# Altium project Плата измерителя УШЯИ.687243.352.PrjPcb
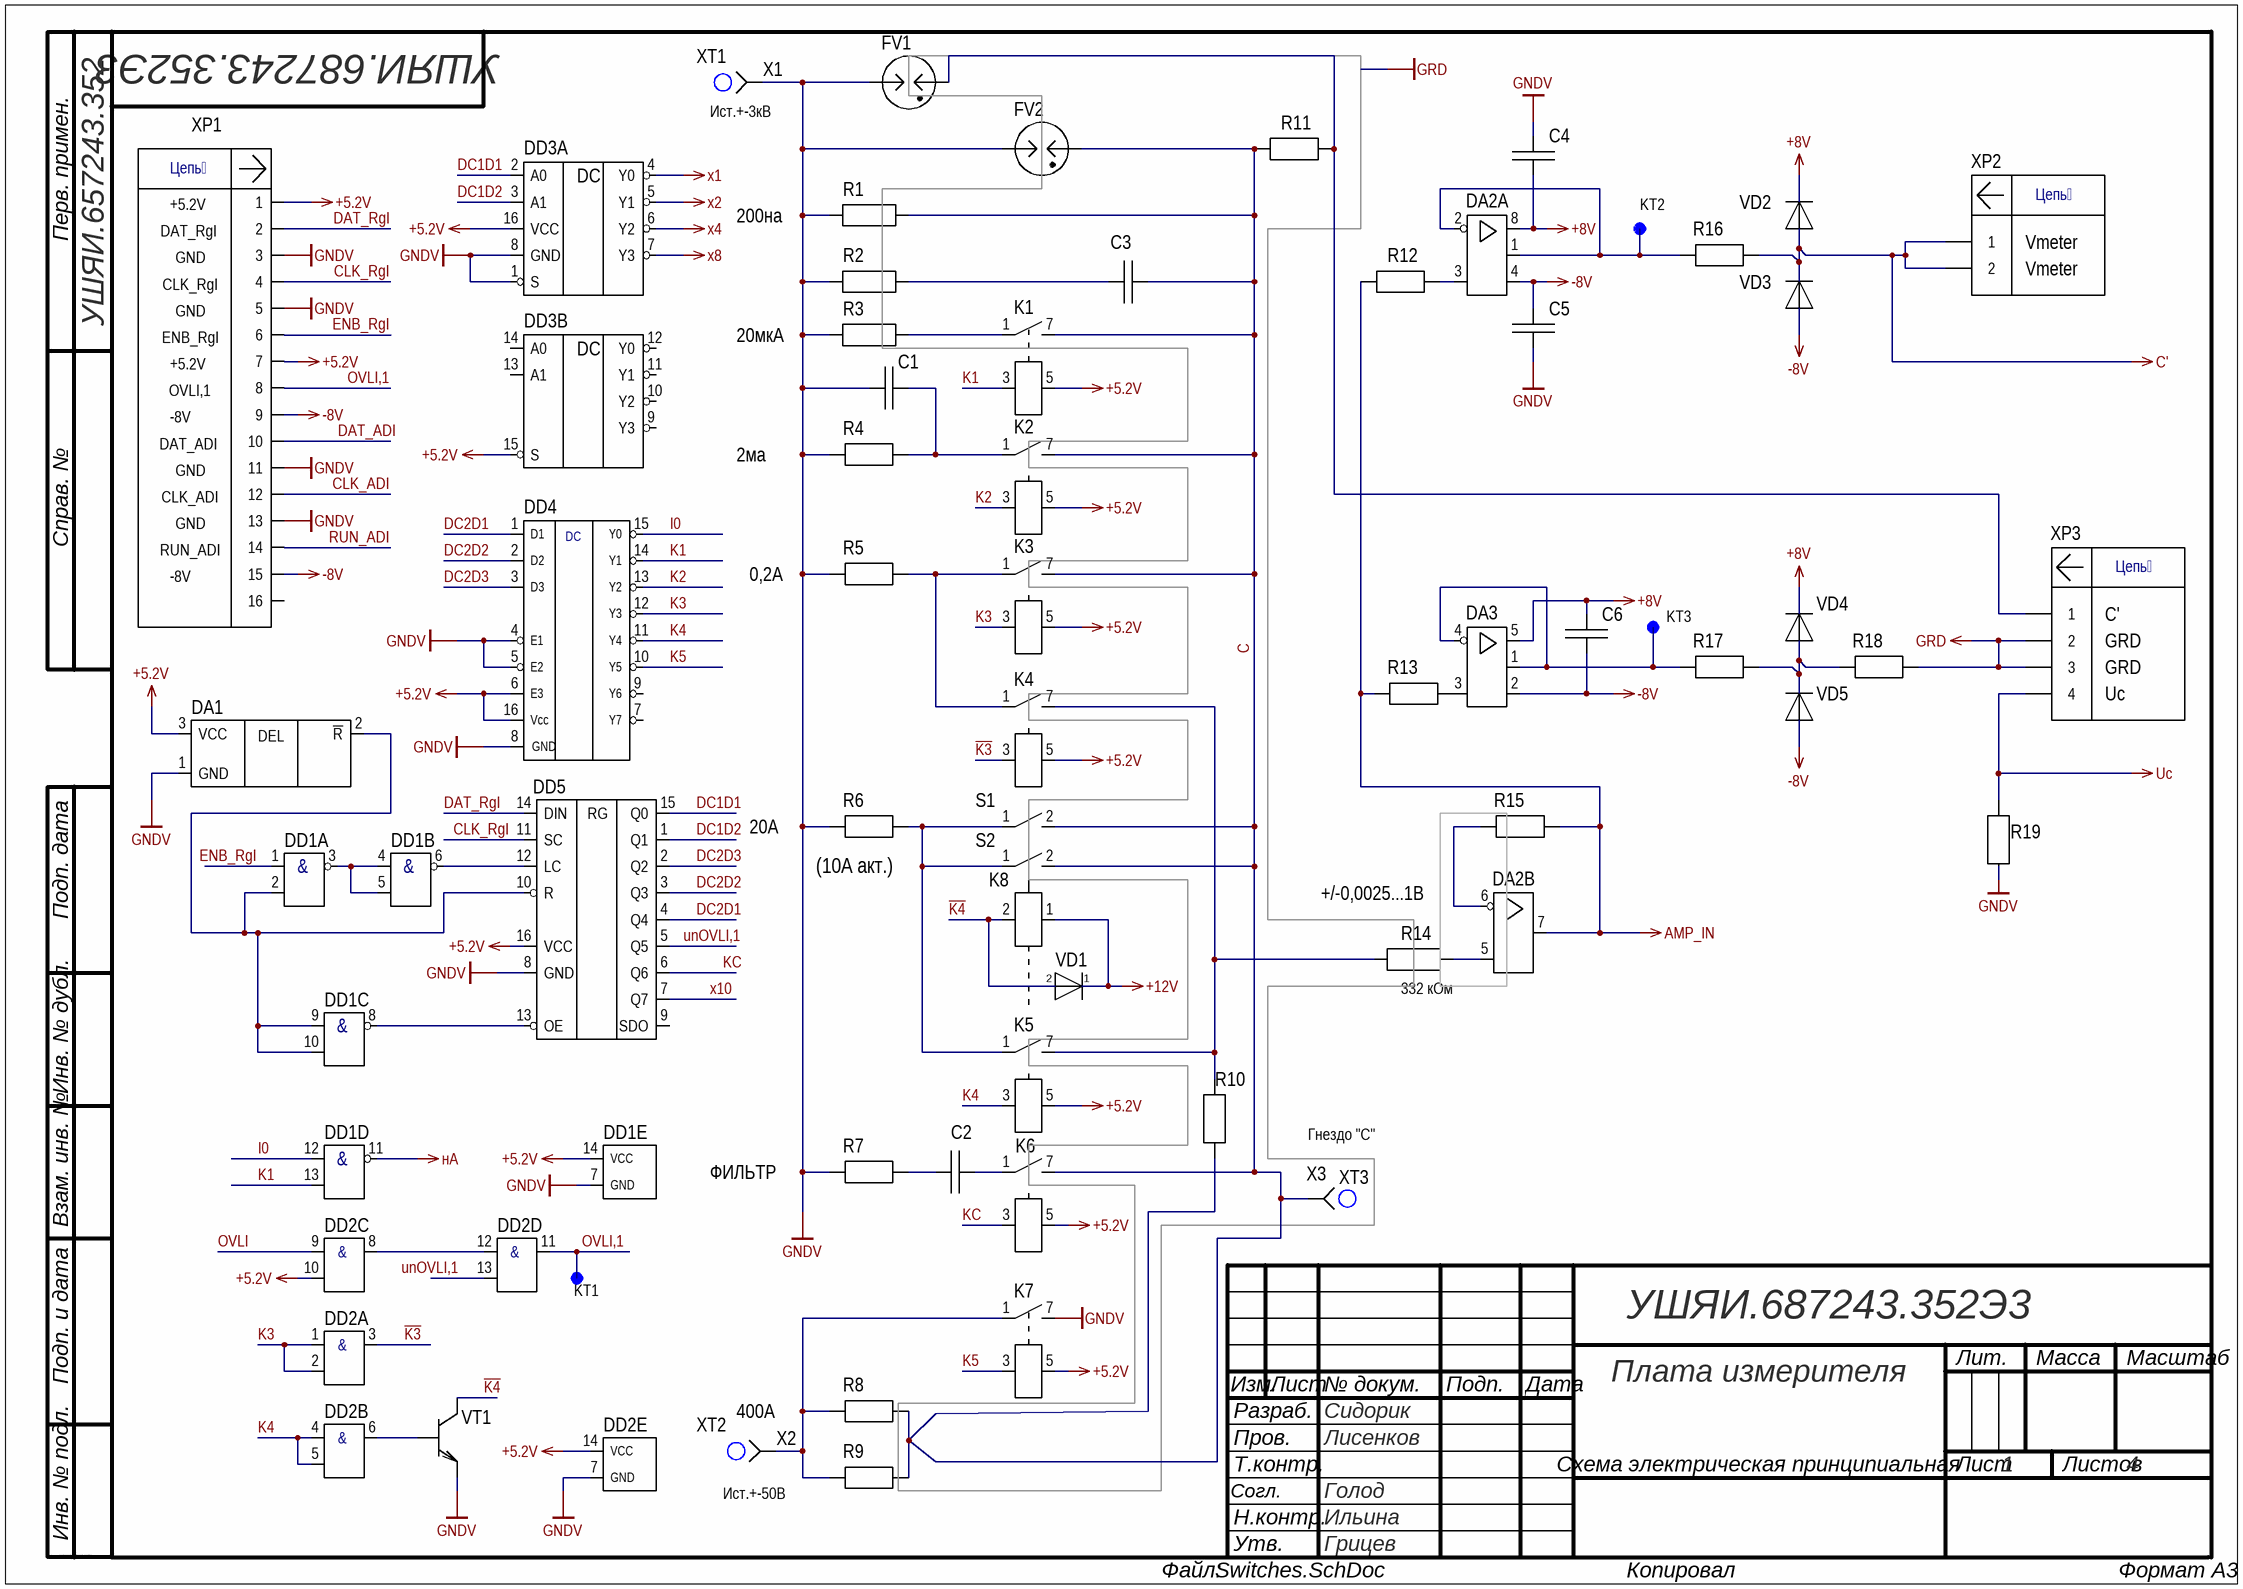
[diagram p0: Switches.SchDoc]
Вид_документа_SCH: Схема электрическая принципиальная; Документация0: А4#УШЯИ.687243.352#Сборочный чертеж (СБ)#СБ##; Документация1: А4#УШЯИ.687243.352#Перечень элементов (ПЭ3)#ПЭ3##; Документация2: А4#УШЯИ.687243.352#Схема электрическая принципиальная (Э3)#Э3##; Код_документа_SCH: Э3; Наименование: Плата измерителя; Наименование1: Плата измерителя; Наименование_PCB: Плата печатная; Обозначение: УШЯИ.687243.352; Обозначение_PCB: УШЯИ.758725.634; Обозначение_Код: УШЯИ.687243.352Э3; Перв.Примен.: УШЯИ.657243.352; ПервПримен: УШЯИ.657243.352; Характер_работы: Согл.; п_Доп_графа: Голод; п_Доп_графа_Р: Голод; п_Н_контр: Ильина; п_Н_контр_Р: Ильина; п_Пров: Лисенков; п_Пров_Р: Лисенков; п_Разраб: Сидорик; п_Разраб_Р: Сидорик; п_Т_Контр: Андриянчик; п_Утв: Грицев; п_Утв_Р: Грицев
4 sheets, 199 parts. Net scope: global (net labels, ports and power ports of the same name join across sheets).
Board file: УШЯИ 758725.634.PcbDoc
Sheets:
  Switches.SchDoc
  Amplifier.SchDoc
  Comparator.SchDoc
  PowerSupply.SchDoc

## Sheet Switches.SchDoc
size 420 x 297 mm; SheetNumber: 1; SheetTotal: 4

### Parts
C1  1206-XP7-630 B-3,3 нФ+-10%  [CAP: 1206]  (value not drawn)
C2  1206-XP7-500 B-15 нФ+-10%  [CAP: 1206]  (value not drawn)
C3  1206-NP0-500 B-270 пФ+-5%  [CAP: 1206]  (value not drawn)
C4  1206-X7R-50 B-0,1 мкФ+-10%  [CAP: 1206]  (value not drawn)
C5  1206-X7R-50 B-0,1 мкФ+-10%  [CAP: 1206]  (value not drawn)
C6  1206-X7R-50 B-0,1 мкФ+-10%  [CAP: 1206]  (value not drawn)
DA1  MAX809S  [SOT-23-3]  (value not drawn)
DA2  TLV9152IDR  [8-SOIC]  (value not drawn)  (parts A,B of 2)
DA3  TLV9151IDR  [SOT-23-5]  (value not drawn)
DD1  IN74HC00AD  [14-soic]  (value not drawn)  (parts A,B,C,D,E of 5)
DD2  IN74HC08AD  [14-SOIC]  (value not drawn)  (parts A,B,C,D,E of 5)
DD3  IN74HC139AD  [16-SOIC]  (value not drawn)  (parts A,B of 2)
DD4  IN74HC138AD  [16-SOIC]  (value not drawn)
DD5  IN74HC595AD  [16-SOIC]  (value not drawn)
FV1  2027-09-B19  [2027-09-B19]  (value not drawn)
FV2  2027-09-B19  [2027-09-B19]  (value not drawn)
K1  SIL05-1A72-71L  [SIL051A7271L]  (value not drawn)
K2  SIL05-1A72-71L  [SIL051A7271L]  (value not drawn)
K3  SIL05-1A72-71L  [SIL051A7271L]  (value not drawn)
K4  SIL05-1A72-71L  [SIL051A7271L]  (value not drawn)
K5  SIL05-1A72-71L  [SIL051A7271L]  (value not drawn)
K6  SIL05-1A72-71L  [SIL051A7271L]  (value not drawn)
K7  SIL05-1A72-71L  [SIL051A7271L]  (value not drawn)
K8  УШЯИ.685442.092vs2Rel  [УШЯИ.685442.092vs2Rel]  (value not drawn)
KT1  OTV10  [OTV10]  (value not drawn)  (no BOM)
KT2  OTV10  [OTV10]  (value not drawn)  (no BOM)
KT3  OTV10  [OTV10]  (value not drawn)  (no BOM)
R1  С2-29В-0,25-4,99 МОм +-0.1%  [С2-29В-0,25(140.02.0204.00.00)]  (value not drawn)
R2  С2-29В-0,125-22 Ом +-0.1%-1,0-А  [С2-29В-0,125(140.02.0202.00.00)]  (value not drawn)
R3  С2-29В-0,125-49,9 кОм +-0.1%-1,0-А  [С2-29В-0,125(140.02.0202.00.00)]  (value not drawn)
R4  1206-499 Ом+-0,1%  [1206]  (value not drawn)
R5  1206-4,99 Ом+-0,1%  [1206]  (value not drawn)
R6  OAR5-R050FLF  [OAR5]  (value not drawn)
R7  1206-27 Ом+-5%  [1206]  (value not drawn)
R8  WSL5931L5000FEA  [WSL5931L5000FEA]  (value not drawn)
R9  WSL5931L5000FEA  [WSL5931L5000FEA]  (value not drawn)
R10  1206-91 кОм+-5%  [1206]  (value not drawn)
R11  1210-100 Ом+-5%  [1210]  (value not drawn)
R12  1206-470 Ом+-5%  [1206]  (value not drawn)
R13  1206-470 Ом+-5%  [1206]  (value not drawn)
R14  С2-29В-0,125-332 кОм+-0.1%-1,0-А  [С2-29В-0,125(140.02.0202.00.00)]  (value not drawn)
R15  1206-470 Ом+-5%  [1206]  (value not drawn)
R16  1206-51 Ом+-5%  [1206]  (value not drawn)
R17  1206-22 Ом+-5%  [1206]  (value not drawn)
R18  1206-22 Ом+-5%  [1206]  (value not drawn)
R19  1210-1,1 кОм+-5%  [1210]  (value not drawn)
S1  DRA282G  (value not drawn)
S2  DRA282G  (value not drawn)
VD1  1N4148WS  [SOD-323F]  (value not drawn)
VD2  1N4007WS  [SOD-323]  (value not drawn)
VD3  1N4007WS  [SOD-323]  (value not drawn)
VD4  1N4007WS  [SOD-323]  (value not drawn)
VD5  1N4007WS  [SOD-323]  (value not drawn)
VT1  FZT658  [SOT-23-4]  (value not drawn)
X1  TR-1,25-4  (value not drawn)
X2  TR-1,25-4  (value not drawn)
X3  TR-1,25-4  (value not drawn)
XP1  DS1014-16SF1B  [DS1014-16S]  (value not drawn)
XP2  280370-2  [280370-2]  (value not drawn)
XP3  280371-2  [280371-2]  (value not drawn)
XT1  УШЯИ.685631.123  [УШЯИ.685631.123]  (value not drawn)  (no BOM)
XT2  УШЯИ.685631.123  [УШЯИ.685631.123]  (value not drawn)  (no BOM)
XT3  УШЯИ.685631.123  [УШЯИ.685631.123]  (value not drawn)  (no BOM)

### Nets
+5.2V: DA1.3(VCC) DD1.14(VCC) DD2.10(B3) DD2.14(VCC) DD3.15(S) DD3.16(VCC) DD4.6(E3) DD4.16(Vcc) DD5.16(VCC) K1.5(COIL_2) K2.5(COIL_2) K3.5(COIL_2) K4.5(COIL_2) K5.5(COIL_2) K6.5(COIL_2) K7.5(COIL_2) XP1.1 XP1.7
+8V: C4.1 C6.2 DA2.8(Vs+) DA3.5(Vs+) VD2.1 VD4.1
+12V: K8.1(COIL_1) VD1.1
-8V: C5.2 C6.1 DA2.4(Vs-) DA3.2(Vs-) VD3.2 VD5.2 XP1.9 XP1.15
AMP_IN: DA2.7(OUT) R12.2 R13.2 R15.2
C': R16.2 VD2.2 VD3.1 XP2.1 XP2.2
GNDV: C1.1 C4.2 C5.1 DA1.1(GND) DD1.7(GND) DD2.7(GND) DD3.1(S) DD3.8(GND) DD4.4(E1) DD4.5(E2) DD4.8(GND) DD5.8(GND) FV1.1 FV2.1 K7.7(COM) R1.1 R2.1 R3.1 R4.1 R5.1 R6.1 R7.1 R19.1 VT1.3(E) X1.1 XP1.3 XP1.5 XP1.11 XP1.13
GRD: R18.2 XP3.2 XP3.3
Uc: R19.2 XP3.4
x1: DD3.4(Y0)
x2: DD3.5(Y1)
x4: DD3.6(Y2)
x8: DD3.7(Y3)
x10: DD5.7(Q7)
нА: DD1.11(Y4)
~{K3}: DD2.3(Y1) K4.3(COIL_1)
~{K4}: K8.2(COIL_2) VD1.2 VT1.2(C)
C: C3.2 FV2.2 K1.7(COM) K2.7(COM) K3.7(COM) K6.7(COM) R1.2 R8.2 R9.2 R10.1 R11.1 S1.2(COM) S2.2(COM) X3.1
CLK_ADI: XP1.12
CLK_RgI: DD5.11(SC) XP1.4
DAT_ADI: XP1.10
DAT_RgI: DD5.14(DIN) XP1.2
DC1D1: DD3.2(A0) DD5.15(Q0)
DC1D2: DD3.3(A1) DD5.1(Q1)
DC2D1: DD4.1(D1) DD5.4(Q4)
DC2D2: DD4.2(D2) DD5.3(Q3)
DC2D3: DD4.3(D3) DD5.2(Q2)
ENB_RgI: DD1.1(A1) XP1.6
I0: DD1.12(A4) DD4.15(Y0)
K1: DD1.13(B4) DD4.14(Y1) K1.3(COIL_1)
K2: DD4.13(Y2) K2.3(COIL_1)
K3: DD2.1(A1) DD2.2(B1) DD4.12(Y3) K3.3(COIL_1)
K4: DD2.4(A2) DD2.5(B2) DD4.11(Y4) K5.3(COIL_1)
K5: DD4.10(Y5) K7.3(COIL_1)
KC: DD5.6(Q6) K6.3(COIL_1)
OVLI: DD2.9(A3)
OVLI,1: DD2.11(Y4) KT1.1 XP1.8
RUN_ADI: XP1.14
unOVLI,1: DD2.13(B4) DD5.5(Q5)
NetC1_2: C1.2 K2.1(NO) R4.2
NetC2_1: C2.1 R7.2
NetC2_2: C2.2 K6.1(NO)
NetC3_1: C3.1 R2.2
NetDA1_2: DA1.2(~{R}) DD1.2(B1) DD1.9(A3) DD1.10(B3) DD5.10(R)
NetDA2_1: DA2.1(OUT) DA2.2(-IN) KT2.1 R16.1
NetDA2_3: DA2.3(+IN) R12.1
NetDA2_5: DA2.5(+IN) R14.1
NetDA2_6: DA2.6(-IN) R15.1
NetDA3_1: DA3.1(OUT) DA3.4(-IN) KT3.1 R17.1
NetDA3_3: DA3.3(+IN) R13.1
NetDD1_3: DD1.3(Y1) DD1.4(A2) DD1.5(B2)
NetDD1_6: DD1.6(Y2) DD5.12(LC)
NetDD1_8: DD1.8(Y3) DD5.13(OE)
NetDD2_6: DD2.6(Y2) VT1.1(B)
NetDD2_8: DD2.8(Y3) DD2.12(A4)
NetFV1_2: FV1.2 R11.2 XP3.1
NetK1_1: K1.1(NO) R3.2
NetK3_1: K3.1(NO) K4.1(NO) R5.2
NetK4_7: K4.7(COM) K5.7(COM) R10.2 R14.2
NetK5_1: K5.1(NO) R6.2 S1.1(NO) S2.1(NO)
NetK7_1: K7.1(NO) R8.1 R9.1 X2.1
NetR17_2: R17.2 R18.1 VD4.2 VD5.1

Not connected (* = marked no-connect by the designer): DD3 9(Y3) 10(Y2) 11(Y1) 12(Y0) 13(A1) 14(A0); DD4 7(Y7) 9(Y6); DD5 9(SDO); XP1 16

### Notes on the sheet
- Ист.+-3кВ
- (near XP1) DAT_RgI
- +5.2V
- 200на
- (near XP2) Vmeter
- (near XP1) CLK_RgI
- GND
- (near XP1) ENB_RgI
- (near XP1) OVLI,1
- 20мкА
- (near XP1) DAT_ADI
- -8V
- 2ма
- (near XP1) CLK_ADI
- (near XP1) RUN_ADI
- (near R5) 0,2А
- (near XP3) GRD
- (near XP3) C'
- (near XP3) Uc
- 20А
- (near R6) (10А акт.)
- (near DA2) +/-0,0025...1В
- (near R14) 332 кОм
- ФИЛЬТР
- Гнездо "C"
- 400А
- Ист.+-50В
- Перв. примен.
- Справ. №
- Подп. дата
- Инв. № дубл.
- Взам. инв. №
- Подп. и дата
- Изм.
- Разраб.
- Лист
- № докум.
- Подп.
- Дата
- Лит.
- Масса
- Масштаб
- Пров.
- Т.контр.
- Листов
- Инв. № подл.
- Н.контр.
- Утв.
- ALTIUM GOSTBOM2.0 KEV
- Файл:
- Копировал
- Формат А3
- (in symbol 280370-2) Цепь
- (in symbol 280371-2) Цепь
- (in symbol DS1014-16SF1B) Цепь
- (in symbol IN74HC00AD, part A) &
- (in symbol IN74HC00AD, part B) &
- (in symbol IN74HC00AD, part C) &
- (in symbol IN74HC00AD, part D) &
- (in symbol IN74HC08AD, part A) &
- (in symbol IN74HC08AD, part B) &
- (in symbol IN74HC08AD, part C) &
- (in symbol IN74HC08AD, part D) &
- (in symbol IN74HC138AD) DC
- (in symbol IN74HC139AD, part A) DC
- (in symbol IN74HC139AD, part B) DC
- (in symbol IN74HC595AD) RG
- (in symbol MAX809S) DEL

### Library data of the parts
C1 = 1206-XP7-630 B-3,3 нФ+-10%: Value: 3,3 нФ
C2 = 1206-XP7-500 B-15 нФ+-10%: Value: 15 нФ
C3 = 1206-NP0-500 B-270 пФ+-5%: Value: 22 пФ
C4-C6 = 1206-X7R-50 B-0,1 мкФ+-10%: Value: 0,1 мкФ
DA1 = MAX809S: Very Low Supply Current / 3-Pin Microprocessor Reset / Monitors
DD1 = IN74HC00AD: Quad 2-Input NAND Gate High-Performance Silicon-Gate CMOS.
DD2 = IN74HC08AD: Quad 2-Input AND Gate High-Performance Silicon-Gate CMOS
DD3 = IN74HC139AD: Decoder/Demultiplexer Dual 2-to-4
DD4 = IN74HC138AD: Дешифратор-демультиплексор IN74HC138A / 3-8 с инверсией на выходе
DD5 = IN74HC595AD: 8-Bit SIPO Register w/ Latch & 3-State
K1-K7 = SIL05-1A72-71L: Relay or Contactor
R1 = С2-29В-0,25-4,99 МОм +-0.1%: Резисторы постоянные непроволочные прецизионные С2-29В, производитель "АО"НПО"ЭРКОН""АО"НПО"ЭРКОН"; Номинальная мощность рассеяния: 0,25 Вт; Диапазон значений номинальных сопротивлений: от 1 Ом до 5,11 МОм; Ряд сопротивлений: Е192; Категории качества: ВП; ТУ: ОЖО.467.099 ТУ
R2 = С2-29В-0,125-22 Ом +-0.1%-1,0-А: Резисторы постоянные непроволочные прецизионные С2-29В, производитель "АО"НПО"ЭРКОН""АО"НПО"ЭРКОН"; Номинальная мощность рассеяния: 0,125 Вт; Диапазон значений номинальных сопротивлений: от 1 Ом до 1 МОм; Ряд сопротивлений: Е192; Категории качества: ВП; ТУ: ОЖО.467.099 ТУ
R3 = С2-29В-0,125-49,9 кОм +-0.1%-1,0-А: Резисторы постоянные непроволочные прецизионные С2-29В, производитель "АО"НПО"ЭРКОН""АО"НПО"ЭРКОН"; Номинальная мощность рассеяния: 0,125 Вт; Диапазон значений номинальных сопротивлений: от 1 Ом до 1 МОм; Ряд сопротивлений: Е192; Категории качества: ВП; ТУ: ОЖО.467.099 ТУ
R4 = 1206-499 Ом+-0,1%: Value: 499 Ом; ModelPrint: 1206
R5 = 1206-4,99 Ом+-0,1%: Value: 4,99 Ом; ModelPrint: 1206
R6 = OAR5-R050FLF: ModelPrint: 0402; Value: 0.05 Ом
R7 = 1206-27 Ом+-5%: Value: 27 Ом; ModelPrint: 1206
R8 R9 = WSL5931L5000FEA: ModelPrint: 1206; Value: 0,5 миллиОм
R10 = 1206-91 кОм+-5%: Value: 91 кОм; ModelPrint: 1206
R11 = 1210-100 Ом+-5%: ModelPrint: 1206; Value: 100 Ом
R12 R13 R15 = 1206-470 Ом+-5%: Value: 470 Ом; ModelPrint: 1206
R14 = С2-29В-0,125-332 кОм+-0.1%-1,0-А: Резисторы постоянные непроволочные прецизионные С2-29В, производитель "АО"НПО"ЭРКОН""АО"НПО"ЭРКОН"; Номинальная мощность рассеяния: 0,125 Вт; Диапазон значений номинальных сопротивлений: от 1 Ом до 1 МОм; Ряд сопротивлений: Е192; Категории качества: ВП; ТУ: ОЖО.467.099 ТУ
R16 = 1206-51 Ом+-5%: Value: 51 Ом; ModelPrint: 1206
R17 R18 = 1206-22 Ом+-5%: Value: 22 Ом; ModelPrint: 1206
R19 = 1210-1,1 кОм+-5%: ModelPrint: 1206; Value: 1,1 кОм
VD1 = 1N4148WS: Small Signal Fast Switching Diod; Value: *
VD2-VD5 = 1N4007WS: General Purpose Plastic Rectifier; Value: *
VT1 = FZT658: pin to pad: 2>2+4
X1-X3 = TR-1,25-4: Клемма TR-1,25-4
XP1 = DS1014-16SF1B: pitch 2mm, 16 pin 2x8, straight
XP2 = 280370-2: Connector
XP3 = 280371-2: Connector

## Sheet Amplifier.SchDoc
size 420 x 297 mm; SheetNumber: 2; SheetTotal: 4
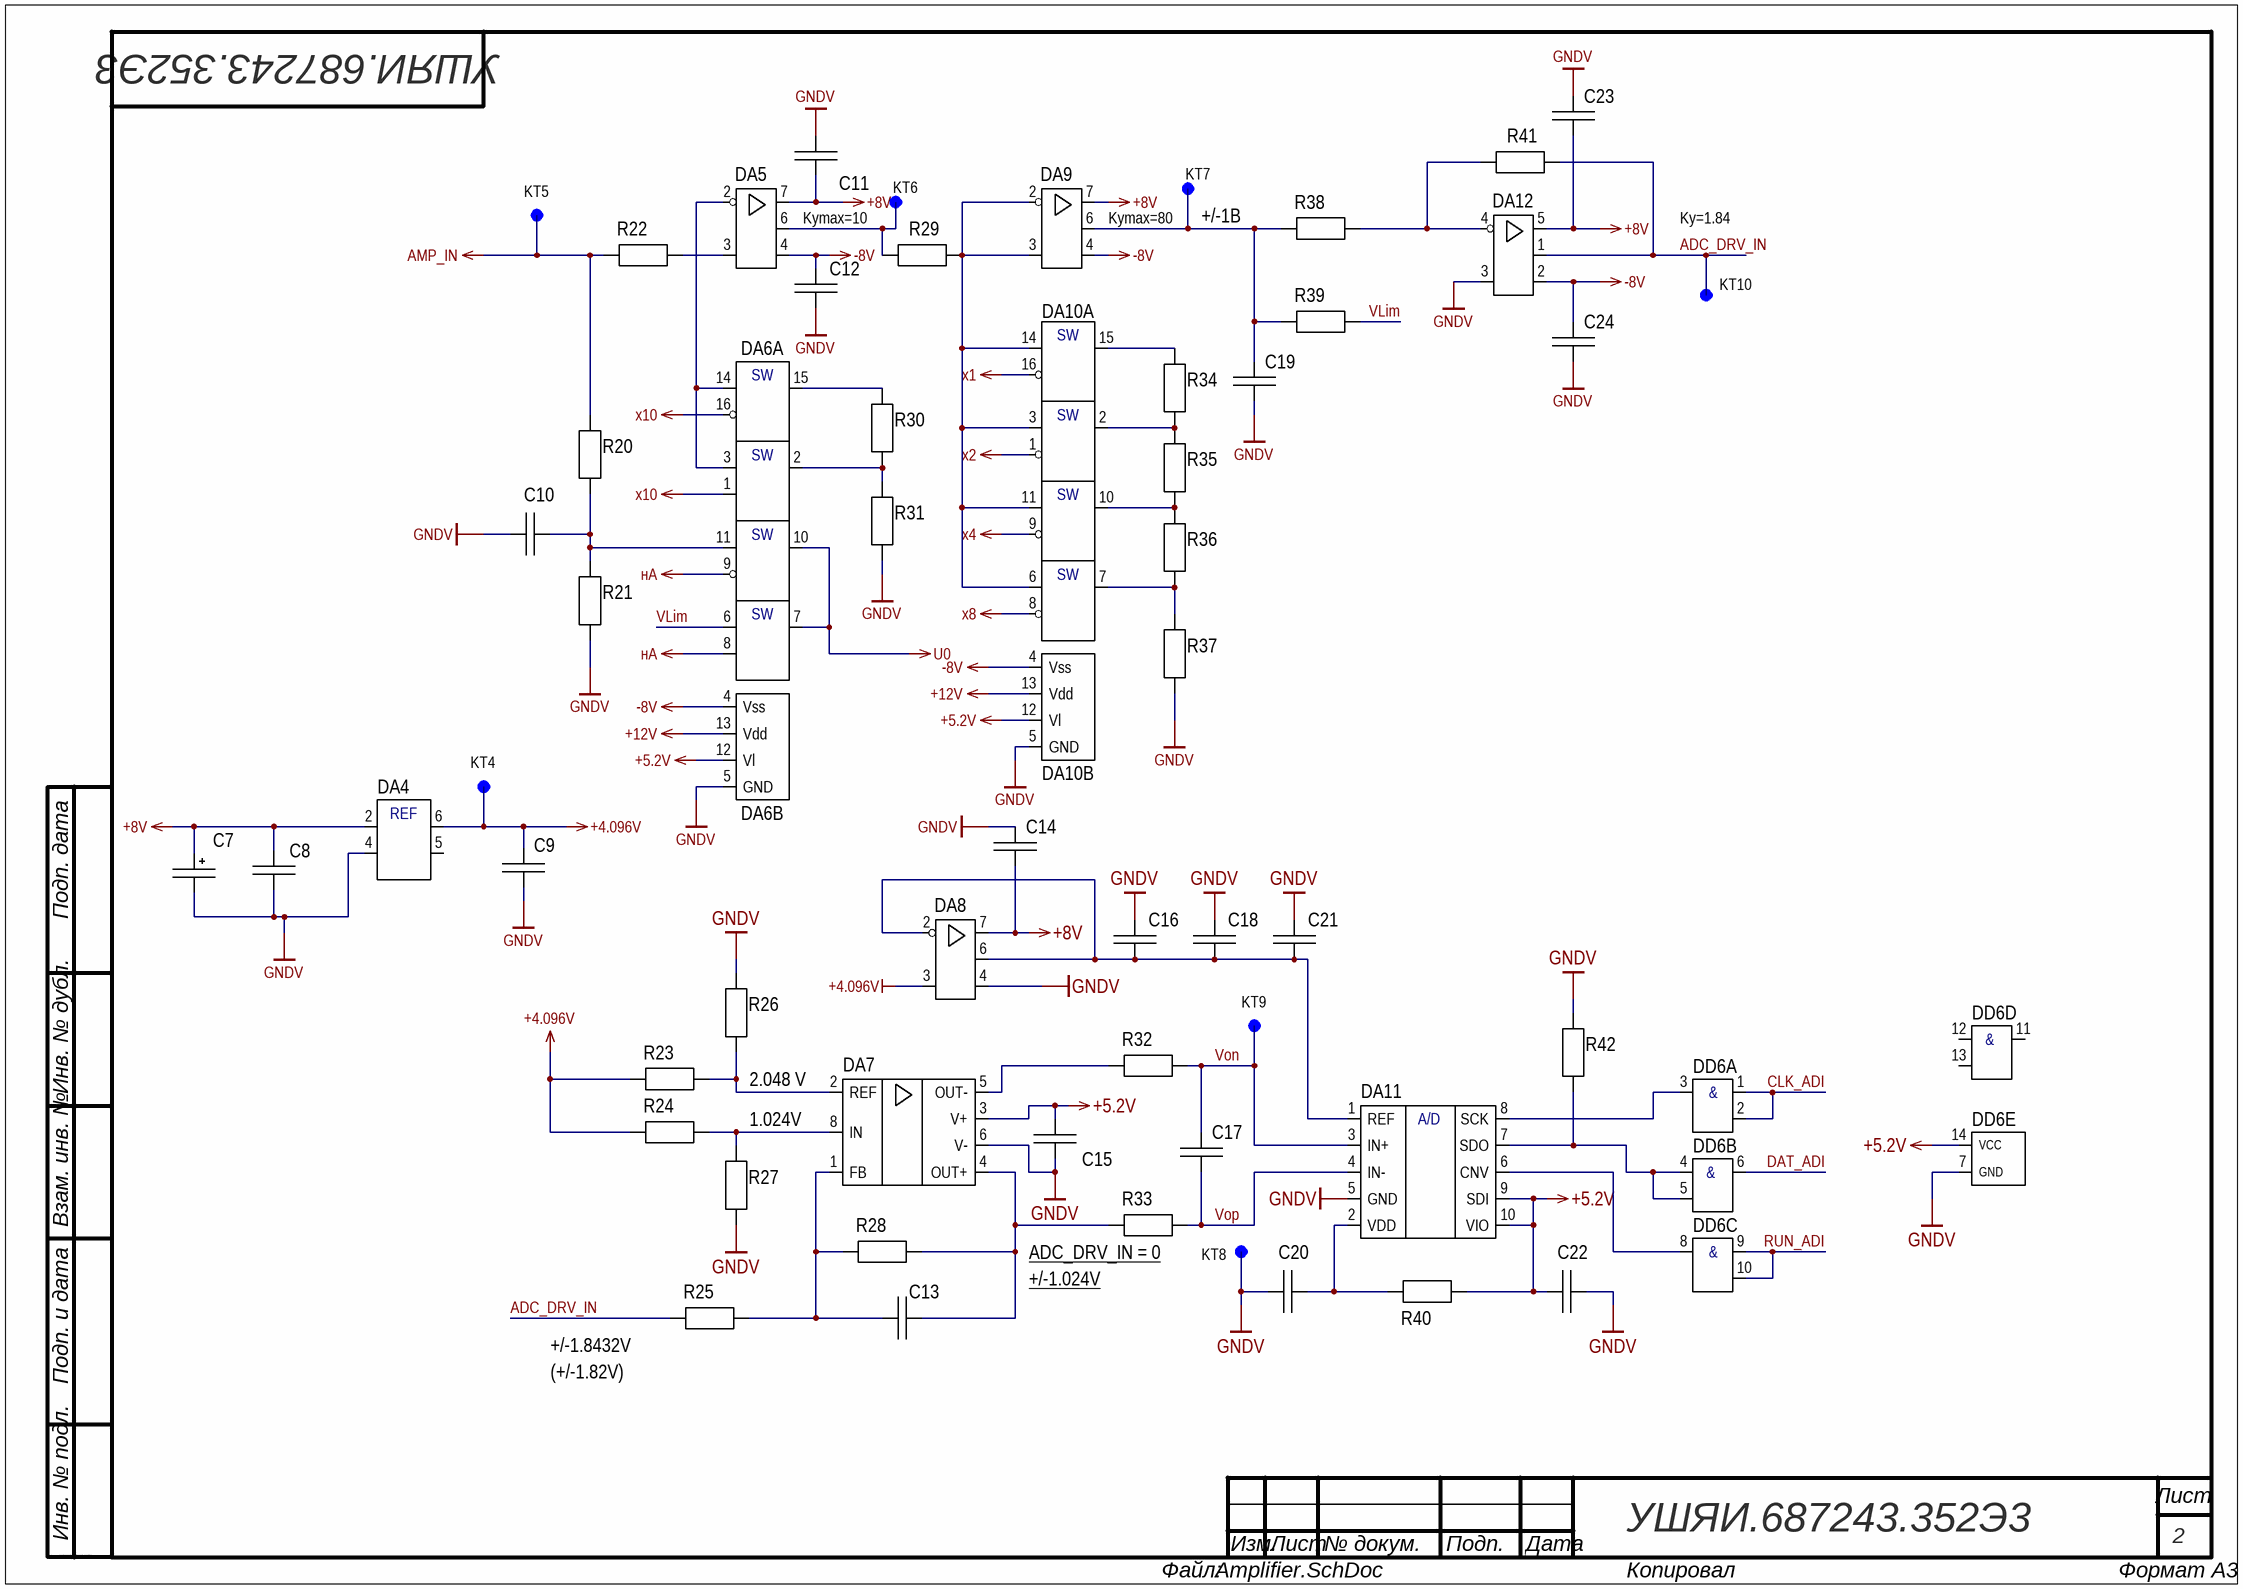
[diagram p1: Amplifier.SchDoc]

### Parts
C7  JRB-50В-4,7мкФ  [CAP TH ALUM ELEC D5.00mm S2.00mm H11.00mm]  (value not drawn)
C8  1206-X7R-50 B-0,1 мкФ+-10%  [CAP: 1206]  (value not drawn)
C9  0805-X7R-25 В-0,1 мкФ +-10%  [CAP: 0805]  (value not drawn)
C10  1206-X7R-50 B-0,01 мкФ+-10%  [CAP: 1206]  (value not drawn)
C11  1206-X7R-50 B-0,1 мкФ+-10%  [CAP: 1206]  (value not drawn)
C12  1206-X7R-50 B-0,1 мкФ+-10%  [CAP: 1206]  (value not drawn)
C13  0805-C0G-50 В-240 пФ +-5%  [CAP: 0805]  (value not drawn)
C14  1206-X7R-50 B-0,1 мкФ+-10%  [CAP: 1206]  (value not drawn)
C15  1206-X7R-50 B-0,1 мкФ+-10%  [CAP: 1206]  (value not drawn)
C16  1206-X7R-10 B-10 мкФ+-10%  [CAP: 1206]  (value not drawn)
C17  1206-X7R-50 B-0,01 мкФ+-10%  [CAP: 1206]  (value not drawn)
C18  1206-X7R-50 B-2,2 мкФ+-10%  [CAP: 1206]  (value not drawn)
C19  1206-X7R-50 B-0,01 мкФ+-10%  [CAP: 1206]  (value not drawn)
C20  1206-X7R-50 B-2,2 мкФ+-10%  [CAP: 1206]  (value not drawn)
C21  1206-X7R-50 B-2,2 мкФ+-10%  [CAP: 1206]  (value not drawn)
C22  1206-X7R-50 B-0,33 мкФ+-10%  [CAP: 1206]  (value not drawn)
C23  1206-X7R-50 B-0,1 мкФ+-10%  [CAP: 1206]  (value not drawn)
C24  1206-X7R-50 B-0,1 мкФ+-10%  [CAP: 1206]  (value not drawn)
DA4  ADR434BR  [8-SOIC]  (value not drawn)
DA5  ADA4637-1ARZ  [8-SOIC]  (value not drawn)
DA6  ADG433BR  [16-SOIC]  (value not drawn)  (parts A,B of 5)
DA7  ADA4941-1YRZ  [8-SOIC]  (value not drawn)
DA8  AD8031BRZ  [8-SOIC]  (value not drawn)
DA9  ADA4637-1ARZ  [8-SOIC]  (value not drawn)
DA10  ADG431BR  [16-SOIC]  (value not drawn)  (parts A,B of 5)
DA11  AD7691BRM  [10-MSOP]  (value not drawn)
DA12  TLV9151IDR  [SOT-23-5]  (value not drawn)
DD6  IN74HC08AD  [14-SOIC]  (value not drawn)  (parts A,B,C,D,E of 5)
KT4  OTV10  [OTV10]  (value not drawn)  (no BOM)
KT5  OTV10  [OTV10]  (value not drawn)  (no BOM)
KT6  OTV10  [OTV10]  (value not drawn)  (no BOM)
KT7  OTV10  [OTV10]  (value not drawn)  (no BOM)
KT8  OTV10  [OTV10]  (value not drawn)  (no BOM)
KT9  OTV10  [OTV10]  (value not drawn)  (no BOM)
KT10  OTV10  [OTV10]  (value not drawn)  (no BOM)
R20  1206-5,1 кОм+-5%  [1206]  (value not drawn)
R21  1206-20 кОм+-5%  [1206]  (value not drawn)
R22  1206-470 Ом+-5%  [1206]  (value not drawn)
R23  0805-1 кОм+-0,1%  [0805]  (value not drawn)
R24  0805-1 кОм+-0,1%  [0805]  (value not drawn)
R25  0805-1 кОм+-0,1%  [0805]  (value not drawn)
R26  0805-1 кОм+-0,1%  [0805]  (value not drawn)
R27  0805-332 Ом+-0,1%  [0805]  (value not drawn)
R28  0805-1 кОм+-0,1%  [0805]  (value not drawn)
R29  1206-470 Ом+-5%  [1206]  (value not drawn)
R30  1206-9,09 кОм+-1%  [1206]  (value not drawn)
R31  1206-1 кОм+-1%  [1206]  (value not drawn)
R32  1206-51 Ом+-5%  [1206]  (value not drawn)
R33  1206-51 Ом+-5%  [1206]  (value not drawn)
R34  1206-4,02 кОм+-0,1%  [1206]  (value not drawn)
R35  1206-2 кОм+-0.1%  [1206]  (value not drawn)
R36  1206-1 кОм+-0.1%  [1206]  (value not drawn)
R37  1206-1 кОм+-0.1%  [1206]  (value not drawn)
R38  1206-1 кОм+-0.1%  [1206]  (value not drawn)
R39  1206-5,1 кОм+-5%  [1206]  (value not drawn)
R40  1206-10 Ом+-5%  [1206]  (value not drawn)
R41  1206-1,82 кОм+-0,1%  [1206]  (value not drawn)
R42  1206-10 кОм+-5%  [1206]  (value not drawn)

### Nets
+4.096V: C9.2 DA4.6(Vout) DA8.3(+IN) KT4.1 R23.1 R24.1
+5.2V: C15.1 C22.1 DA6.12(Vl) DA7.3(V+) DA10.12(Vl) DA11.9(SDI) DA11.10(VIO) DD6.14(VCC) R40.2
+8V: C7.1 C8.2 C11.2 C14.1 C23.1 DA4.2(+Vin) DA5.7(Vs+) DA8.7(Vs+) DA9.7(Vs+) DA12.5(Vs+)
+12V: DA6.13(Vdd) DA10.13(Vdd)
-8V: C12.1 C24.2 DA5.4(Vs-) DA6.4(Vss) DA9.4(Vs-) DA10.4(Vss) DA12.2(Vs-)
AMP_IN: KT5.1 R20.2 R22.1
GNDV: C7.2 C8.1 C9.1 C10.2 C11.1 C12.2 C14.2 C15.2 C16.2 C18.2 C19.1 C20.1 C21.2 C22.2 C23.2 C24.1 DA4.4(GND) DA6.5(GND) DA7.6(V-) DA8.4(Vs-) DA10.5(GND) DA11.5(GND) DA12.3(+IN) DD6.7(GND) KT8.1 R21.1 R26.2 R27.1 R31.1 R37.1 R42.1
U0: DA6.7(D4) DA6.10(D3)
x1: DA10.16(IN2)
x2: DA10.1(IN1)
x4: DA10.9(IN3)
x8: DA10.8(IN4)
x10: DA6.1(IN1) DA6.16(IN2)
нА: DA6.8(IN4) DA6.9(IN3)
ADC_DRV_IN: DA12.1(OUT) KT10.1 R25.1 R41.2
CLK_ADI: DD6.1(A1) DD6.2(B1)
DAT_ADI: DD6.6(Y2)
RUN_ADI: DD6.9(A3) DD6.10(B3)
VLim: DA6.6(S4) R39.1
Von: C17.2 DA11.3(IN+) KT9.1 R32.2
Vop: C17.1 DA11.4(IN-) R33.2
NetC10_1: C10.1 DA6.11(S3) R20.1 R21.2
NetC13_1: C13.1 DA7.1(FB) R25.2 R28.1
NetC13_2: C13.2 DA7.4(OUT+) R28.2 R33.1
NetC16_1: C16.1 C18.1 C21.1 DA8.2(-IN) DA8.6(OUT) DA11.1(REF)
NetC19_2: C19.2 DA9.6(OUT) KT7.1 R38.1 R39.2
NetC20_2: C20.2 DA11.2(VDD) R40.1
NetDA5_2: DA5.2(-IN) DA6.3(S1) DA6.14(S2)
NetDA5_3: DA5.3(+IN) R22.2
NetDA5_6: DA5.6(OUT) KT6.1 R29.1
NetDA6_2: DA6.2(D1) R30.1 R31.2
NetDA6_15: DA6.15(D2) R30.2
NetDA7_2: DA7.2(REF) R23.2 R26.1
NetDA7_5: DA7.5(OUT-) R32.1
NetDA7_8: DA7.8(IN) R24.2 R27.2
NetDA9_2: DA9.2(-IN) DA9.3(+IN) DA10.3(S1) DA10.6(S4) DA10.11(S3) DA10.14(S2) R29.2
NetDA10_2: DA10.2(D1) R34.1 R35.2
NetDA10_7: DA10.7(D4) R36.1 R37.2
NetDA10_10: DA10.10(D3) R35.1 R36.2
NetDA10_15: DA10.15(D2) R34.2
NetDA11_6: DA11.6(CNV) DD6.8(Y3)
NetDA11_7: DA11.7(SDO) DD6.4(A2) DD6.5(B2) R42.2
NetDA11_8: DA11.8(SCK) DD6.3(Y1)
NetDA12_4: DA12.4(-IN) R38.2 R41.1

Not connected (* = marked no-connect by the designer): DA4 5(TRIM); DD6 11(Y4) 12(A4) 13(B4)

### Notes on the sheet
- Kymax=10
- Kymax=80
- (near KT7) +/-1В
- Ky=1.84
- 2.048 V
- 1.024V
- (near R33) ADC_DRV_IN = 0
- (near R33) +/-1.024V
- (near R25) +/-1.8432V
- (near R25) (+/-1.82V)
- Подп. дата
- Инв. № дубл.
- Взам. инв. №
- Подп. и дата
- Инв. № подл.
- Изм.
- Лист
- № докум.
- Подп.
- Дата
- ALTIUM GOSTBOM2.0 KEV
- Файл:
- Копировал
- Формат А3
- (in symbol AD7691BRM) A/D
- (in symbol ADG431BR, part A) SW
- (in symbol ADG433BR, part A) SW
- (in symbol ADR434BR) REF
- (in symbol IN74HC08AD, part A) &
- (in symbol IN74HC08AD, part B) &
- (in symbol IN74HC08AD, part C) &
- (in symbol IN74HC08AD, part D) &

### Library data of the parts
C8 C11 C12 C14 C15 C23 C24 = 1206-X7R-50 B-0,1 мкФ+-10%: Value: 0,1 мкФ
C9 = 0805-X7R-25 В-0,1 мкФ +-10%: Value: 0,1 мкФ
C13 = 0805-C0G-50 В-240 пФ +-5%: Value: 10 пФ
C16 = 1206-X7R-10 B-10 мкФ+-10%: Value: 10 мкФ
C18 C20 C21 = 1206-X7R-50 B-2,2 мкФ+-10%: Value: 2,2 мкФ
DA5 DA9 = ADA4637-1ARZ: 30 V, High Speed, Low Noise, Low Bias / Current, JFET Operational Amplifier
DA6 = ADG433BR: LC2MOS Precision Quad SPST Switches; Value: *
DA7 = ADA4941-1YRZ: Single-Supply, Differential, 18-Bit ADC Driver
DA8 = AD8031BRZ: Rail-to-Rail I/O Amplifiers 2.7 V, 800 μA, 80 MHz
DA10 = ADG431BR: LC2MOS Precision Quad SPST Switches; Value: *
DD6 = IN74HC08AD: as DD2 on sheet Switches
R20 R39 = 1206-5,1 кОм+-5%: Value: 5,1 кОм; ModelPrint: 1206
R21 = 1206-20 кОм+-5%: Value: 20 кОм; ModelPrint: 1206
R22 R29 = 1206-470 Ом+-5%: Value: 470 Ом; ModelPrint: 1206
R23-R26 R28 = 0805-1 кОм+-0,1%: Value: 1 кОм; ModelPrint: 0805
R27 = 0805-332 Ом+-0,1%: Value: 332 Ом; ModelPrint: 0805
R31 = 1206-1 кОм+-1%: Value: 1 кОм; ModelPrint: 1206
R32 R33 = 1206-51 Ом+-5%: Value: 51 Ом; ModelPrint: 1206
R35 = 1206-2 кОм+-0.1%: Value: 2 кОм; ModelPrint: 1206
R36-R38 = 1206-1 кОм+-0.1%: Value: 1 кОм; ModelPrint: 1206
R40 = 1206-10 Ом+-5%: Value: 10 Ом; ModelPrint: 1206
R42 = 1206-10 кОм+-5%: Value: 10 кОм; ModelPrint: 1206
C10 C17 C19 = 1206-X7R-50 B-0,01 мкФ+-10%: Value: 0,01 мкФ
C22 = 1206-X7R-50 B-0,33 мкФ+-10%: Value: 0,33 мкФ
R30 = 1206-9,09 кОм+-1%: ModelPrint: 1206; Value: 9,09 кОм
R34 = 1206-4,02 кОм+-0,1%: ModelPrint: 1206; Value: 4,02 кОм
R41 = 1206-1,82 кОм+-0,1%: ModelPrint: 1206; Value: 1,82 кОм

## Sheet Comparator.SchDoc
size 209 x 297 mm; SheetNumber: 3; SheetTotal: 4
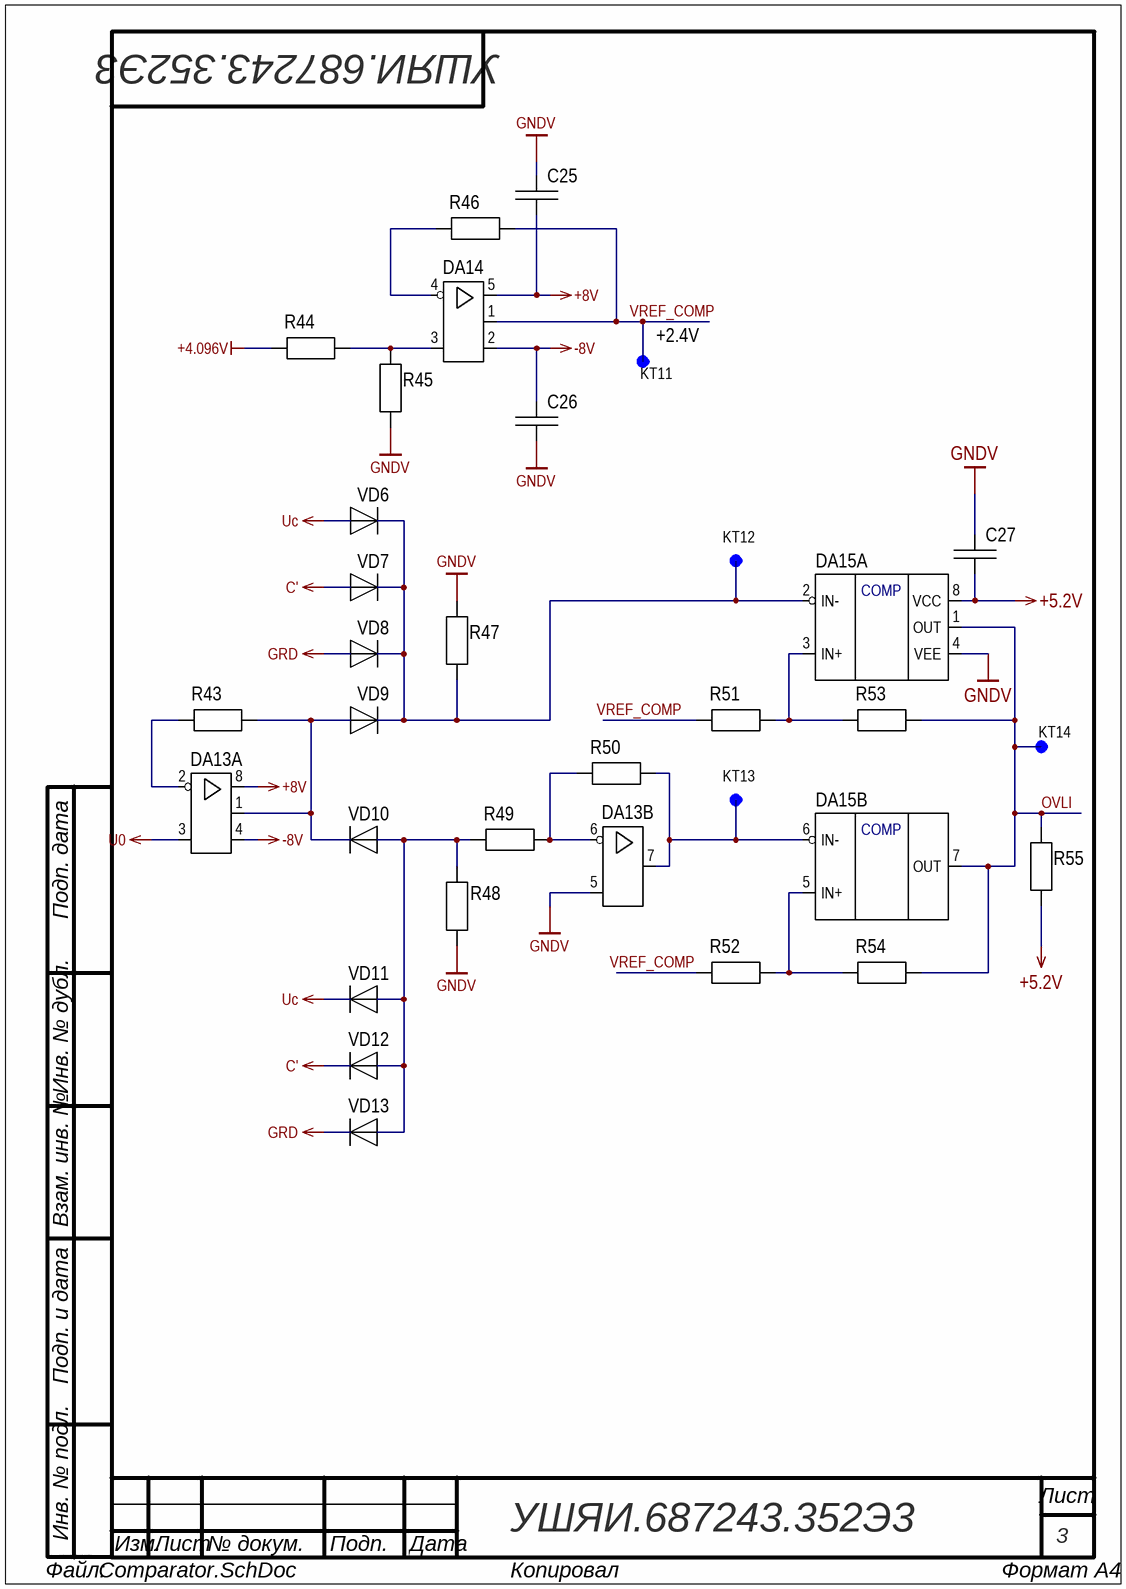
[diagram p2: Comparator.SchDoc]

### Parts
C25  1206-X7R-50 B-0,1 мкФ+-10%  [CAP: 1206]  (value not drawn)
C26  1206-X7R-50 B-0,1 мкФ+-10%  [CAP: 1206]  (value not drawn)
C27  1206-X7R-50 B-0,1 мкФ+-10%  [CAP: 1206]  (value not drawn)
DA13  TLV9152IDR  [8-SOIC]  (value not drawn)  (parts A,B of 2)
DA14  TLV9151IDR  [SOT-23-5]  (value not drawn)
DA15  TLV1842  [8-VSSOP]  (value not drawn)  (parts A,B of 2)
KT11  OTV10  [OTV10]  (value not drawn)  (no BOM)
KT12  OTV10  [OTV10]  (value not drawn)  (no BOM)
KT13  OTV10  [OTV10]  (value not drawn)  (no BOM)
KT14  OTV10  [OTV10]  (value not drawn)  (no BOM)
R43  1206-470 Ом+-5%  [1206]  (value not drawn)
R44  1206-7,15 кОм+-1%  [1206]  (value not drawn)
R45  1206-10 кОм+-0,5%  [1206]  (value not drawn)
R46  1206-470 Ом+-5%  [1206]  (value not drawn)
R47  1206-2,4 кОм+-5%  [1206]  (value not drawn)
R48  1206-2,4 кОм+-5%  [1206]  (value not drawn)
R49  0805-1 кОм+-0,1%  [0805]  (value not drawn)
R50  0805-1 кОм+-0,1%  [0805]  (value not drawn)
R51  0805-1 кОм+-0,1%  [0805]  (value not drawn)
R52  0805-1 кОм+-0,1%  [0805]  (value not drawn)
R53  1206-510 кОм+-1%  [1206]  (value not drawn)
R54  1206-510 кОм+-1%  [1206]  (value not drawn)
R55  1206-4,7 кОм+-5%  [1206]  (value not drawn)
VD6  1N4148WS  [SOD-323F]  (value not drawn)
VD7  1N4148WS  [SOD-323F]  (value not drawn)
VD8  1N4148WS  [SOD-323F]  (value not drawn)
VD9  1N4148WS  [SOD-323F]  (value not drawn)
VD10  1N4148WS  [SOD-323F]  (value not drawn)
VD11  1N4148WS  [SOD-323F]  (value not drawn)
VD12  1N4148WS  [SOD-323F]  (value not drawn)
VD13  1N4148WS  [SOD-323F]  (value not drawn)

### Nets
+4.096V: R44.2
+5.2V: C27.1 DA15.8(VCC) R55.1
+8V: C25.1 DA13.8(Vs+) DA14.5(Vs+)
-8V: C26.2 DA13.4(Vs-) DA14.2(Vs-)
C': VD7.2 VD12.1
GNDV: C25.2 C26.1 C27.2 DA13.5(+IN) DA15.4(VEE) R45.1 R47.2 R48.1
GRD: VD8.2 VD13.1
U0: DA13.3(+IN)
Uc: VD6.2 VD11.1
OVLI: DA15.1(OUT) DA15.7(OUT) KT14.1 R53.2 R54.2 R55.2
VREF_COMP: DA14.1(OUT) KT11.1 R46.2 R51.1 R52.2
NetDA13_1: DA13.1(OUT) R43.2 VD9.2 VD10.1
NetDA13_2: DA13.2(-IN) R43.1
NetDA13_6: DA13.6(-IN) R49.2 R50.1
NetDA13_7: DA13.7(OUT) DA15.6(IN-) KT13.1 R50.2
NetDA14_3: DA14.3(+IN) R44.1 R45.2
NetDA14_4: DA14.4(-IN) R46.1
NetDA15_2: DA15.2(IN-) KT12.1 R47.1 VD6.1 VD7.1 VD8.1 VD9.1
NetDA15_3: DA15.3(IN+) R51.2 R53.1
NetDA15_5: DA15.5(IN+) R52.1 R54.1
NetR48_2: R48.2 R49.1 VD10.2 VD11.2 VD12.2 VD13.2

### Notes on the sheet
- (near KT11) +2.4V
- Подп. дата
- Инв. № дубл.
- Взам. инв. №
- Подп. и дата
- Инв. № подл.
- Изм.
- Лист
- № докум.
- Подп.
- Дата
- Файл:
- ALTIUM GOSTBOM2.0 KEV
- Копировал
- Формат А4
- (in symbol TLV1842, part A) COMP
- (in symbol TLV1842, part B) COMP

### Library data of the parts
C25-C27 = 1206-X7R-50 B-0,1 мкФ+-10%: Value: 0,1 мкФ
DA15 = TLV1842: 40V, High-Speed Comparators; Value: *
R43 R46 = 1206-470 Ом+-5%: Value: 470 Ом; ModelPrint: 1206
R45 = 1206-10 кОм+-0,5%: Value: 10 кОм; ModelPrint: 1206
R47 R48 = 1206-2,4 кОм+-5%: Value: 2,4 кОм; ModelPrint: 1206
R49-R52 = 0805-1 кОм+-0,1%: Value: 1 кОм; ModelPrint: 0805
R53 R54 = 1206-510 кОм+-1%: Value: 510 кОм; ModelPrint: 1206
R55 = 1206-4,7 кОм+-5%: Value: 4,7 кОм; ModelPrint: 1206
VD6-VD13 = 1N4148WS: Small Signal Fast Switching Diod; Value: *
R44 = 1206-7,15 кОм+-1%: ModelPrint: 1206; Value: 7,15 кОм

## Sheet PowerSupply.SchDoc
size 420 x 297 mm; SheetNumber: 4; SheetTotal: 4
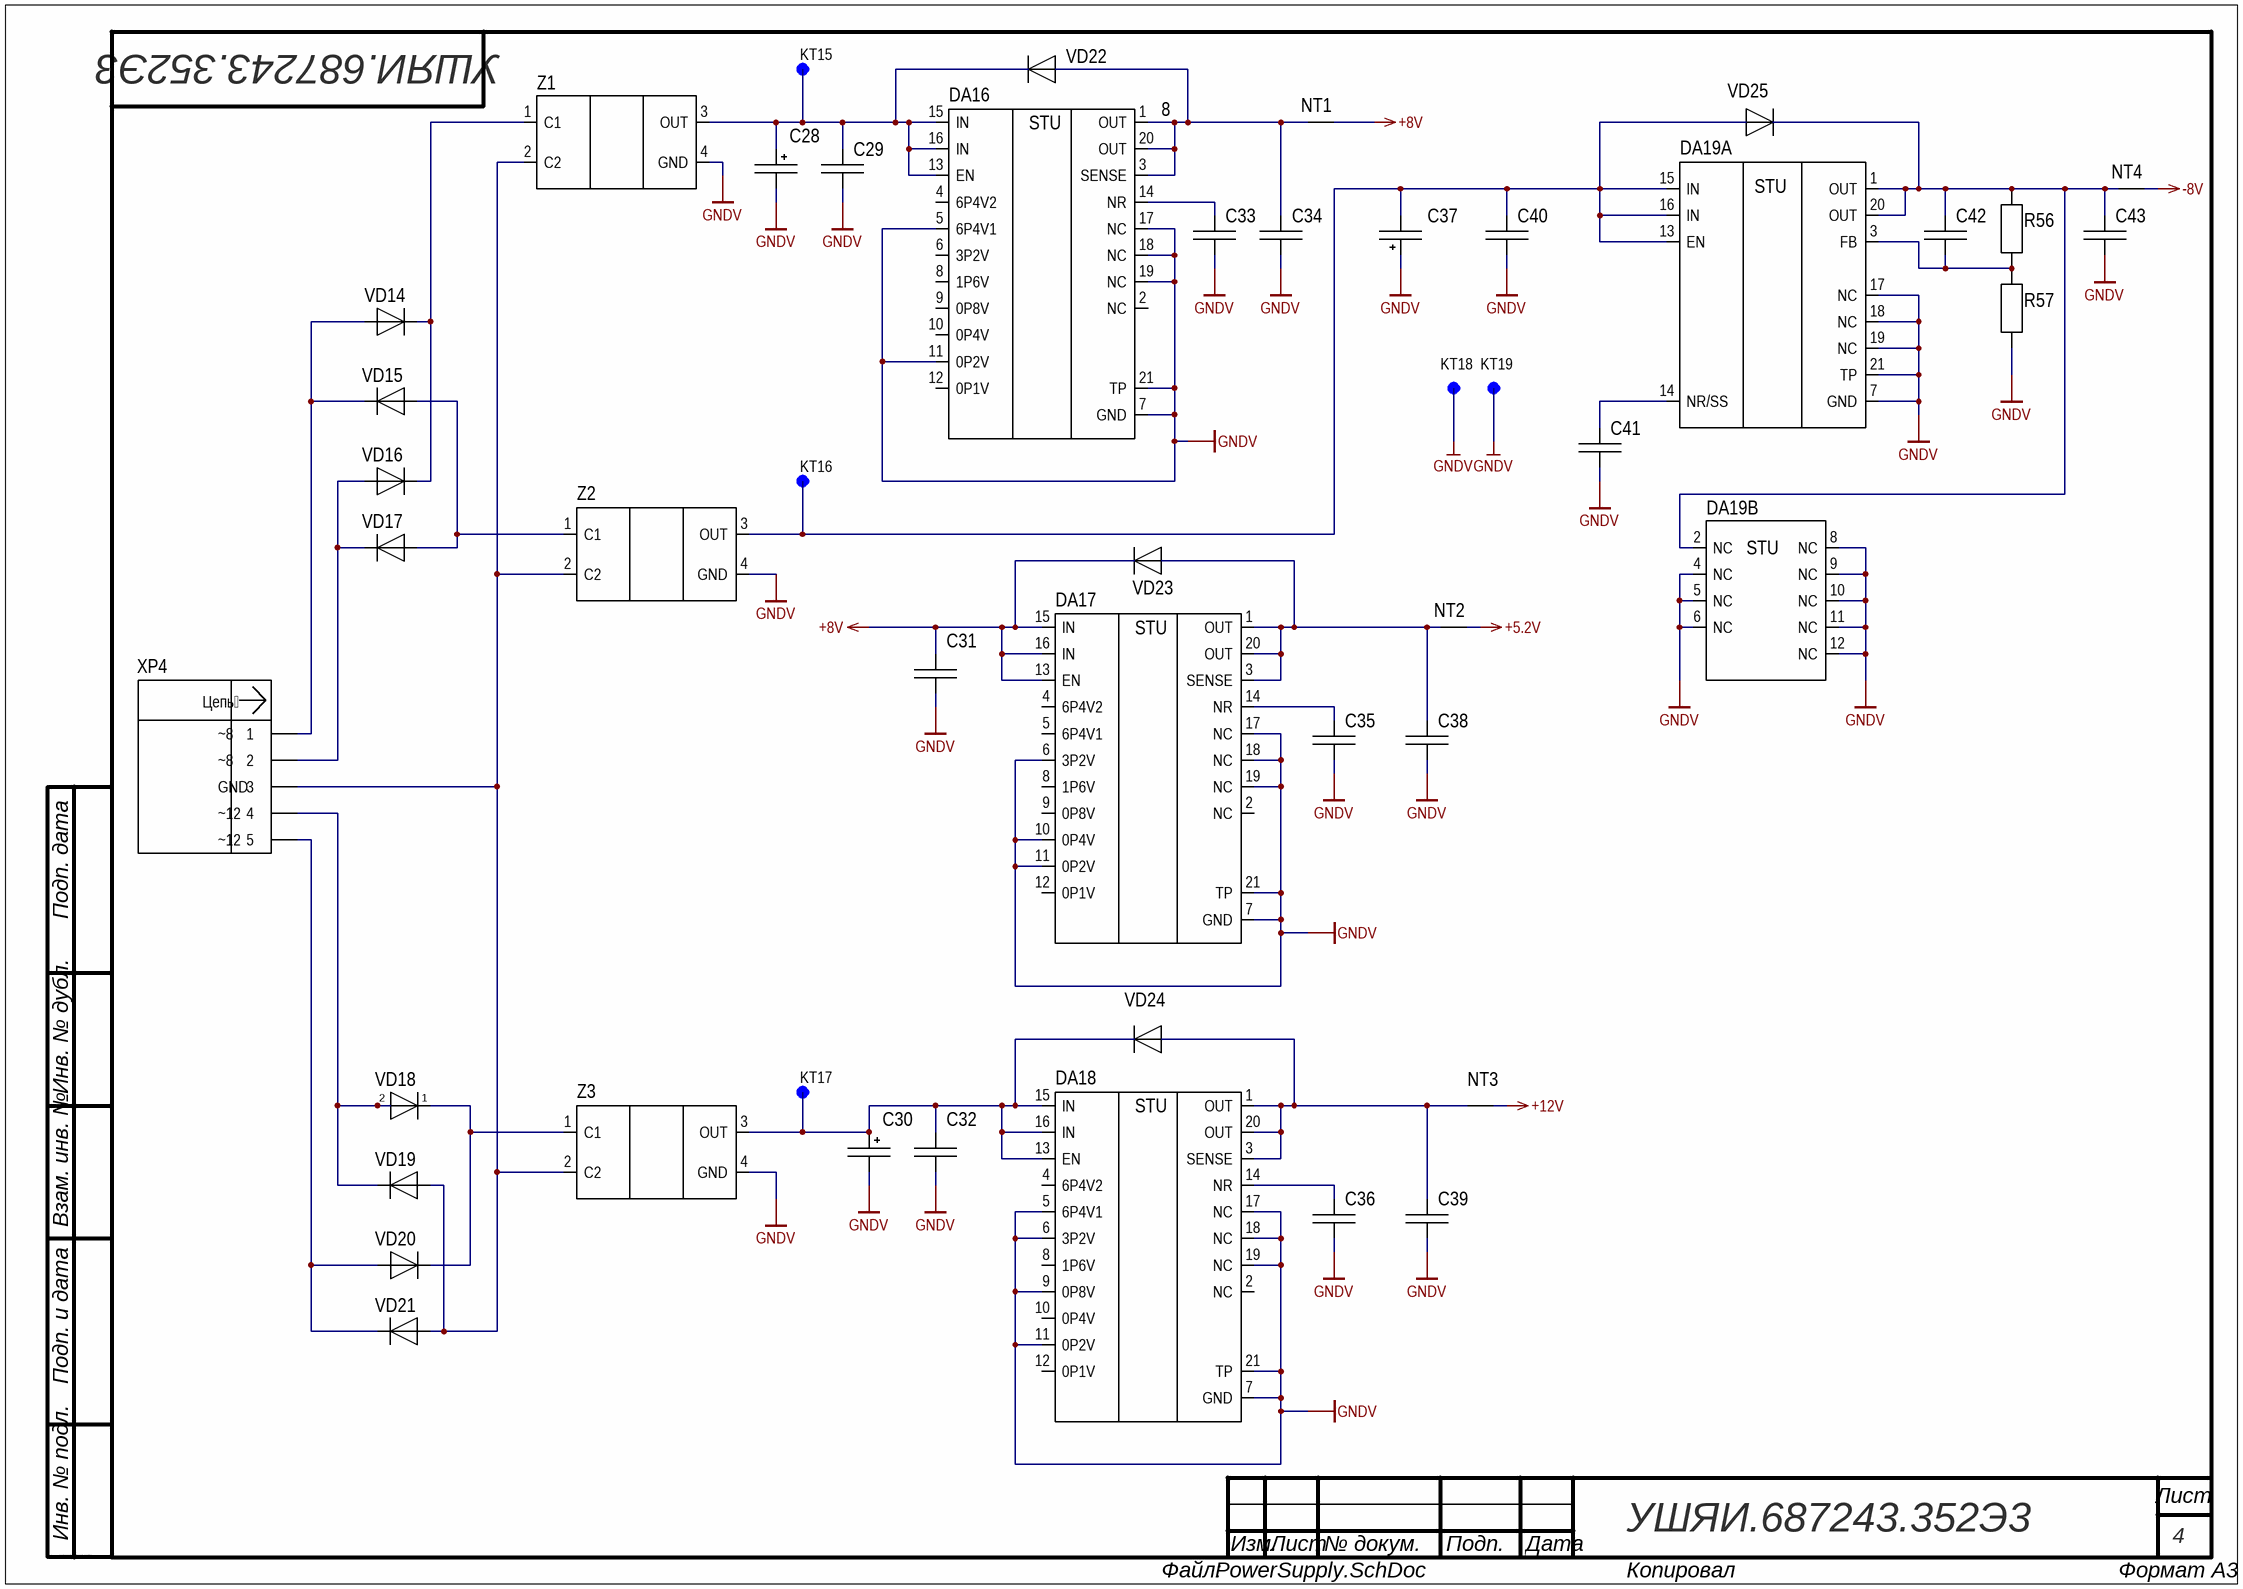
[diagram p3: PowerSupply.SchDoc]

### Parts
C28  JRB-25В-1000 мкФ  [CAP TH ALUM ELEC D10.00mm S5.00mm H21.00mm]  (value not drawn)
C29  1206-X7R-50 B-10 мкФ+-10%  [CAP: 1206]  (value not drawn)
C30  JRB-35В-470мкФ  [CAP TH ALUM ELEC D10.00mm S5.00mm H17.00mm]  (value not drawn)
C31  1206-X7R-50 B-10 мкФ+-10%  [CAP: 1206]  (value not drawn)
C32  1206-X7R-50 B-10 мкФ+-10%  [CAP: 1206]  (value not drawn)
C33  0805-X7R-25 В-1 мкФ +-10%  [CAP: 0805]  (value not drawn)
C34  1206-X7R-25 B-47мкФ+-10%  [CAP: 1206]  (value not drawn)
C35  0805-X7R-25 В-1 мкФ +-10%  [CAP: 0805]  (value not drawn)
C36  0805-X7R-25 В-1 мкФ +-10%  [CAP: 0805]  (value not drawn)
C37  JRB-25В-220мкФ  [CAP TH ALPOLY D8.00mm S3.50mm H12.00mm]  (value not drawn)
C38  1206-X7R-25 B-47мкФ+-10%  [CAP: 1206]  (value not drawn)
C39  1206-X7R-25 B-47мкФ+-10%  [CAP: 1206]  (value not drawn)
C40  1206-X7R-50 B-10 мкФ+-10%  [CAP: 1206]  (value not drawn)
C41  0805-X7R-25 В-1 мкФ +-10%  [CAP: 0805]  (value not drawn)
C42  1206-X7R-50 B-0,01 мкФ+-10%  [CAP: 1206]  (value not drawn)
C43  1206-X7R-25 B-47мкФ+-10%  [CAP: 1206]  (value not drawn)
DA16  TPS7A4701  [20-VQFN]  (value not drawn)
DA17  TPS7A4701  [20-VQFN]  (value not drawn)
DA18  TPS7A4701  [20-VQFN]  (value not drawn)
DA19  TPS7A3301  [20-VQFN]  (value not drawn)  (parts A,B of 2)
KT15  OTV10  [OTV10]  (value not drawn)  (no BOM)
KT16  OTV10  [OTV10]  (value not drawn)  (no BOM)
KT17  OTV10  [OTV10]  (value not drawn)  (no BOM)
KT18  OTV10  [OTV10]  (value not drawn)  (no BOM)
KT19  OTV10  [OTV10]  (value not drawn)  (no BOM)
NT1  NetTie  [NetTie]  (value not drawn)  (net tie, no BOM)
NT2  NetTie  [NetTie]  (value not drawn)  (net tie, no BOM)
NT3  NetTie  [NetTie]  (value not drawn)  (net tie, no BOM)
NT4  NetTie  [NetTie]  (value not drawn)  (net tie, no BOM)
R56  1206-1,24 МОм+-1%  [1206]  (value not drawn)
R57  1206-221 кОм+-1%  [1206]  (value not drawn)
VD14  V1P22  [DO-219AD]  (value not drawn)
VD15  V1P22  [DO-219AD]  (value not drawn)
VD16  V1P22  [DO-219AD]  (value not drawn)
VD17  V1P22  [DO-219AD]  (value not drawn)
VD18  V1P22  [DO-219AD]  (value not drawn)
VD19  V1P22  [DO-219AD]  (value not drawn)
VD20  V1P22  [DO-219AD]  (value not drawn)
VD21  V1P22  [DO-219AD]  (value not drawn)
VD22  1N4148WS  [SOD-323F]  (value not drawn)
VD23  1N4148WS  [SOD-323F]  (value not drawn)
VD24  1N4148WS  [SOD-323F]  (value not drawn)
VD25  1N4148WS  [SOD-323F]  (value not drawn)
XP4  DS1074-5MVT6  [DS1074-5MV]  (value not drawn)
Z1  BNX022-01  [BNX02]  (value not drawn)
Z2  BNX022-01  [BNX02]  (value not drawn)
Z3  BNX022-01  [BNX02]  (value not drawn)

### Nets
+5.2V: NT2.2(N2)
+8V: C31.2 DA17.13(EN) DA17.15(IN) DA17.16(IN) NT1.2(N2) VD23.1
+12V: NT3.2(N2)
-8V: NT4.2(N2)
GNDV: C28.2 C29.1 C30.2 C31.1 C32.1 C33.1 C34.1 C35.1 C36.1 C37.1 C38.1 C39.1 C40.1 C41.1 C43.1 DA16.5(6P4V1) DA16.7(GND) DA16.11(0P2V) DA16.17(NC) DA16.18(NC) DA16.19(NC) DA16.21(TP) DA17.6(3P2V) DA17.7(GND) DA17.10(0P4V) DA17.11(0P2V) DA17.17(NC) DA17.18(NC) DA17.19(NC) DA17.21(TP) DA18.5(6P4V1) DA18.6(3P2V) DA18.7(GND) DA18.9(0P8V) DA18.11(0P2V) DA18.17(NC) DA18.18(NC) DA18.19(NC) DA18.21(TP) DA19.4(NC) DA19.5(NC) DA19.6(NC) DA19.7(GND) DA19.8(NC) DA19.9(NC) DA19.10(NC) DA19.11(NC) DA19.12(NC) DA19.17(NC) DA19.18(NC) DA19.19(NC) DA19.21(TP) KT18.1 KT19.1 R57.1 Z1.4(GND) Z2.4(GND) Z3.4(GND)
NetC28_1: C28.1 C29.2 DA16.13(EN) DA16.15(IN) DA16.16(IN) KT15.1 VD22.1 Z1.3(OUT)
NetC30_1: C30.1 C32.2 DA18.13(EN) DA18.15(IN) DA18.16(IN) KT17.1 VD24.1 Z3.3(OUT)
NetC33_2: C33.2 DA16.14(NR)
NetC34_2: C34.2 DA16.1(OUT) DA16.3(SENSE) DA16.20(OUT) NT1.1(N1) VD22.2
NetC35_2: C35.2 DA17.14(NR)
NetC36_2: C36.2 DA18.14(NR)
NetC37_2: C37.2 C40.2 DA19.13(EN) DA19.15(IN) DA19.16(IN) KT16.1 VD25.2 Z2.3(OUT)
NetC38_2: C38.2 DA17.1(OUT) DA17.3(SENSE) DA17.20(OUT) NT2.1(N1) VD23.2
NetC39_2: C39.2 DA18.1(OUT) DA18.3(SENSE) DA18.20(OUT) NT3.1(N1) VD24.2
NetC41_2: C41.2 DA19.14(NR/SS)
NetC42_1: C42.1 DA19.3(FB) R56.1 R57.2
NetC42_2: C42.2 C43.2 DA19.1(OUT) DA19.2(NC) DA19.20(OUT) NT4.1(N1) R56.2 VD25.1
NetVD14_1: VD14.1(Cathode) VD16.1(Cathode) Z1.1(С1)
NetVD14_2: VD14.2(Anode) VD15.1(Cathode) XP4.1
NetVD15_2: VD15.2(Anode) VD17.2(Anode) Z2.1(С1)
NetVD16_2: VD16.2(Anode) VD17.1(Cathode) XP4.2
NetVD18_1: VD18.1(Cathode) VD20.1(Cathode) Z3.1(С1)
NetVD18_2: VD18.2(Anode) VD19.1(Cathode) XP4.4
NetVD19_2: VD19.2(Anode) VD21.2(Anode) XP4.3 Z1.2(C2) Z2.2(C2) Z3.2(C2)
NetVD20_2: VD20.2(Anode) VD21.1(Cathode) XP4.5

Not connected (* = marked no-connect by the designer): DA16 2(NC) 4(6P4V2) 6(3P2V) 8(1P6V) 9(0P8V) 10(0P4V) 12(0P1V); DA17 2(NC) 4(6P4V2) 5(6P4V1) 8(1P6V) 9(0P8V) 12(0P1V); DA18 2(NC) 4(6P4V2) 8(1P6V) 10(0P4V) 12(0P1V)

### Notes on the sheet
- (near DA16) 8
- Подп. дата
- Инв. № дубл.
- Взам. инв. №
- Подп. и дата
- Инв. № подл.
- Изм.
- Лист
- № докум.
- Подп.
- Дата
- ALTIUM GOSTBOM2.0 KEV
- Файл:
- Копировал
- Формат А3
- (in symbol DS1074-5MVT6) Цепь
- (in symbol TPS7A3301, part A) STU
- (in symbol TPS7A3301, part B) STU
- (in symbol TPS7A4701) STU

### Library data of the parts
C29 C31 C32 C40 = 1206-X7R-50 B-10 мкФ+-10%: Value: 10 мкФ
C33 C35 C36 C41 = 0805-X7R-25 В-1 мкФ +-10%: Value: 1 мкФ
C34 C38 C39 C43 = 1206-X7R-25 B-47мкФ+-10%: Value: 51 пФ
DA16-DA18 = TPS7A4701: TPS7A470x 36-V, 1-A, 4-µVRMS, RF LDO Voltage Regulator
DA19 = TPS7A3301: TPS7A33 –36-V, 1-A, Ultralow-Noise Negative Voltage Regulator
R57 = 1206-221 кОм+-1%: Value: 221 кОм; ModelPrint: 1206
VD14-VD21 = V1P22: Surface-Mount TMBS® (Trench MOS Barrier Schottky) Rectifier; Value: *
VD22-VD25 = 1N4148WS: Small Signal Fast Switching Diod; Value: *
XP4 = DS1074-5MVT6: 1: ~8; 3: GND; 4: ~12; 2: ~8; 5: ~12
C42 = 1206-X7R-50 B-0,01 мкФ+-10%: Value: 0,01 мкФ
R56 = 1206-1,24 МОм+-1%: ModelPrint: 1206; Value: 1,24 МОм

## Nets that join several sheets
+4.096V: Amplifier (6 pins), Comparator (R44.2)
+5.2V: Switches (18 pins), Amplifier (9 pins), Comparator (C27.1 DA15.8 R55.1), PowerSupply (NT2.2)
+8V: Switches (6 pins), Amplifier (10 pins), Comparator (C25.1 DA13.8 DA14.5), PowerSupply (6 pins)
+12V: Switches (K8.1 VD1.1), Amplifier (DA6.13 DA10.13), PowerSupply (NT3.2)
-8V: Switches (8 pins), Amplifier (7 pins), Comparator (C26.2 DA13.4 DA14.2), PowerSupply (NT4.2)
AMP_IN: Switches (DA2.7 R12.2 R13.2 R15.2), Amplifier (KT5.1 R20.2 R22.1)
C': Switches (5 pins), Comparator (VD7.2 VD12.1)
GNDV: Switches (29 pins), Amplifier (31 pins), Comparator (8 pins), PowerSupply (58 pins)
GRD: Switches (R18.2 XP3.2 XP3.3), Comparator (VD8.2 VD13.1)
U0: Amplifier (DA6.7 DA6.10), Comparator (DA13.3)
Uc: Switches (R19.2 XP3.4), Comparator (VD6.2 VD11.1)
x1: Switches (DD3.4), Amplifier (DA10.16)
x2: Switches (DD3.5), Amplifier (DA10.1)
x4: Switches (DD3.6), Amplifier (DA10.9)
x8: Switches (DD3.7), Amplifier (DA10.8)
x10: Switches (DD5.7), Amplifier (DA6.1 DA6.16)
нА: Switches (DD1.11), Amplifier (DA6.8 DA6.9)
CLK_ADI: Switches (XP1.12), Amplifier (DD6.1 DD6.2)
DAT_ADI: Switches (XP1.10), Amplifier (DD6.6)
OVLI: Switches (DD2.9), Comparator (6 pins)
RUN_ADI: Switches (XP1.14), Amplifier (DD6.9 DD6.10)